# EAGLE design ESP32K40 (EAGLE 9.6.2)
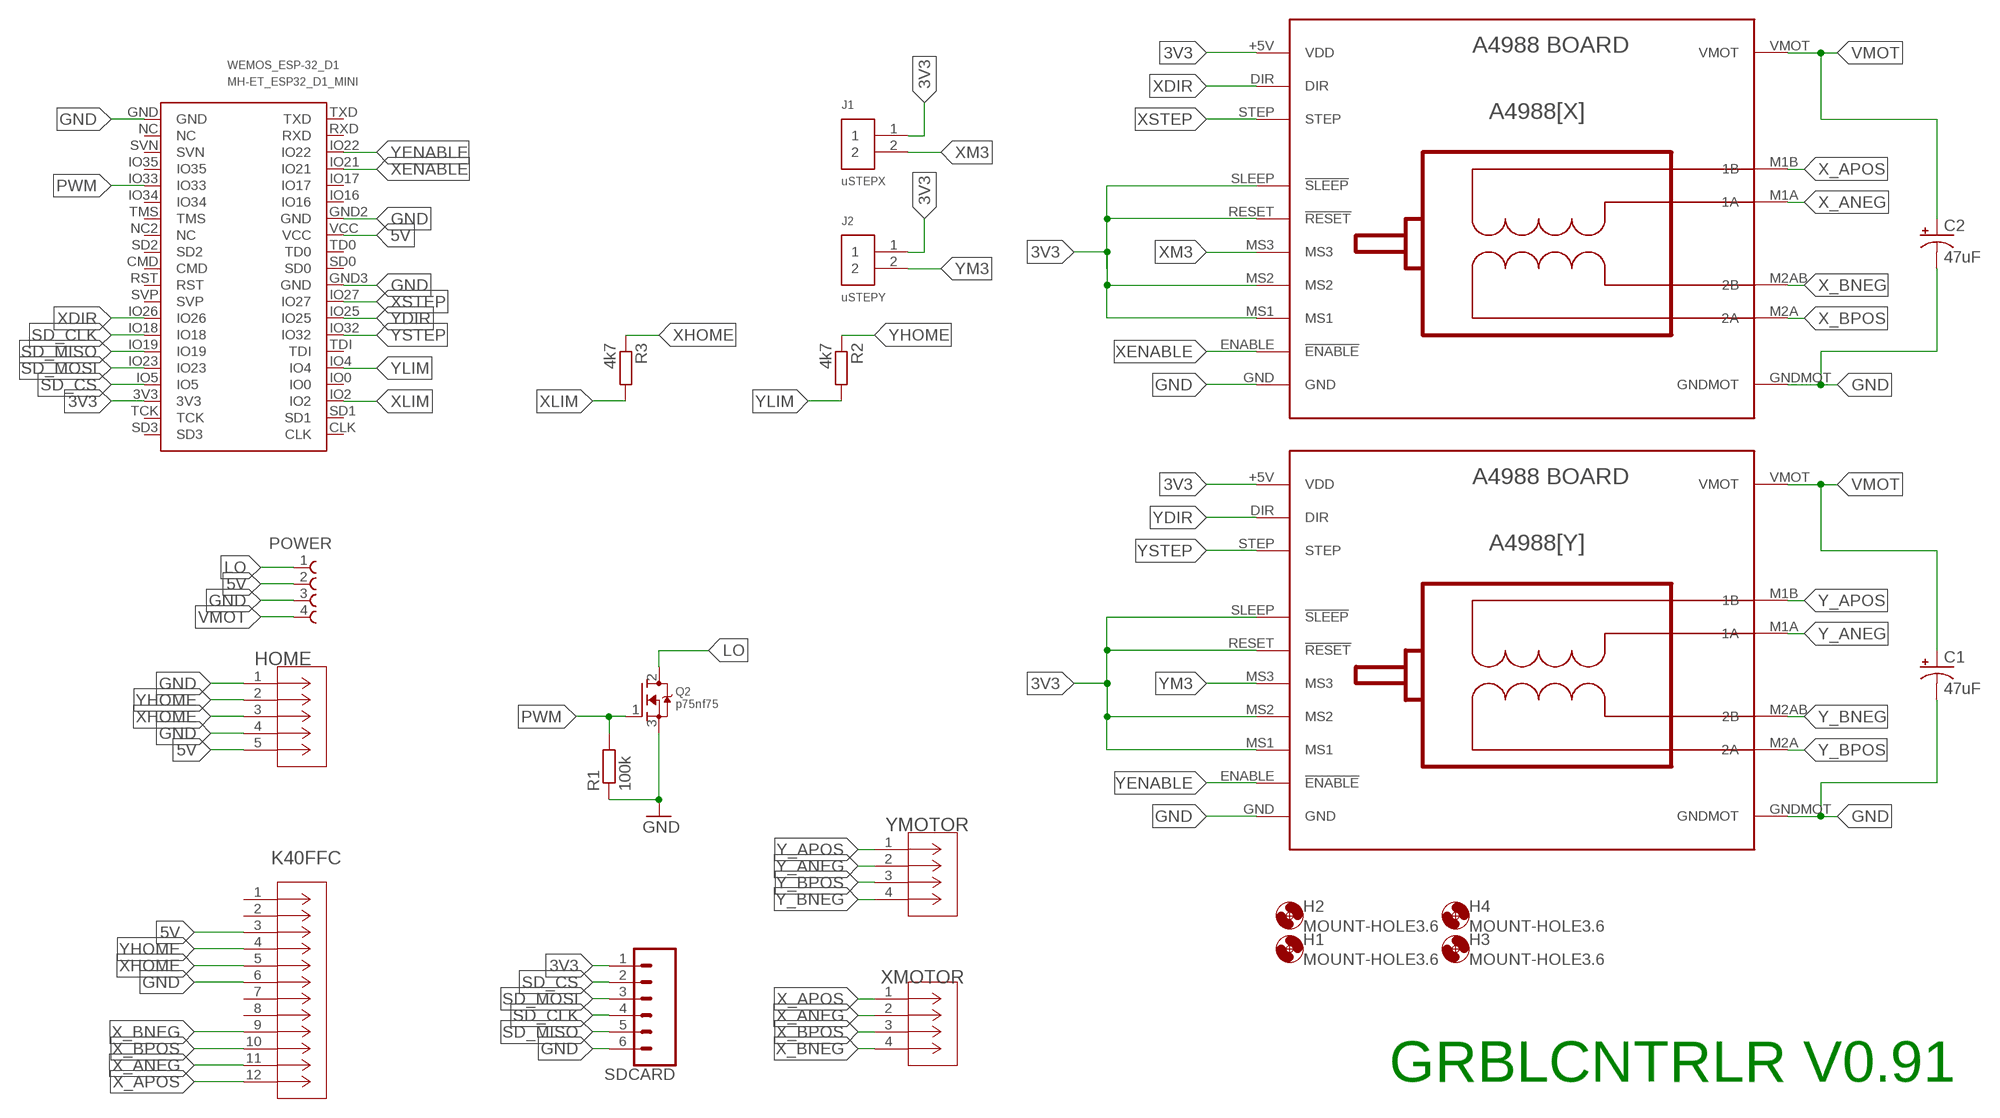
[diagram p0: schematic, sheet 1]

## Parts
A4988[X]  XMOTOR  BOARD_A4988  [BOARD_A4988]
A4988[Y]  YMOTOR  BOARD_A4988  [BOARD_A4988]
C1  47uF  CPOL-USTAP5-70  [TAP5-70]
C2  47uF  CPOL-USTAP5-70  [TAP5-70]
H1  MOUNT-HOLE3.6  [3,6]
H2  MOUNT-HOLE3.6  [3,6]
H3  MOUNT-HOLE3.6  [3,6]
H4  MOUNT-HOLE3.6  [3,6]
HOME  B5B-XH-A(LF)(SN)  [CONN_B5B-XH-A(LF)(SN)_JST]
J1  uSTEPX  61300211121  [61300211121]
J2  uSTEPY  61300211121  [61300211121]
K40FFC  1-84534-2  [CON12_TH_FCC-FPC2]
POWER  691371700004B  [691371700004B]
Q2  p75nf75  MOSFET-NGDS_TO220V  [TO220V]
R1  100k  R-EU_V234/12  [V234/12]
R2  4k7  R-EU_V234/12  [V234/12]
R3  4k7  R-EU_V234/12  [V234/12]
SDCARD  CONN_06LONGPADS  [1X06_LONGPADS]
WEMOS_ESP-32_D1  MH-ET_ESP32_D1_MINI  [MH-ET_ESP32_D1_MINI]
XMOTOR  B4B-XH-A_(LF)(SN)  [CONN_B4B-XH-A_(LF)(SN)_JST]
YMOTOR  B4B-XH-A_(LF)(SN)  [CONN_B4B-XH-A_(LF)(SN)_JST]

## Nets
3V3 [PWR]: A4988[X].+5V(VDD) A4988[X].MS1 A4988[X].MS2 A4988[X].RESET(!RESET) A4988[X].SLEEP(!SLEEP) A4988[Y].+5V(VDD) A4988[Y].MS1 A4988[Y].MS2 A4988[Y].RESET(!RESET) A4988[Y].SLEEP(!SLEEP) J1.1 J2.1 SDCARD.1 WEMOS_ESP-32_D1.3V3
5V [PWR]: HOME.5 K40FFC.3 POWER.2 WEMOS_ESP-32_D1.VCC
GND [MOTOR]: A4988[X].GND A4988[X].GNDMOT A4988[Y].GND A4988[Y].GNDMOT C1.- C2.- HOME.1 HOME.4 K40FFC.6 POWER.3 Q2.3(S) R1.1 SDCARD.6 WEMOS_ESP-32_D1.GND WEMOS_ESP-32_D1.GND2(GND) WEMOS_ESP-32_D1.GND3(GND)
LO: POWER.1 Q2.2(D)
PWM: Q2.1(G) R1.2 WEMOS_ESP-32_D1.IO33
SD_CLK: SDCARD.4 WEMOS_ESP-32_D1.IO18
SD_CS: SDCARD.2 WEMOS_ESP-32_D1.IO5
SD_MISO: SDCARD.5 WEMOS_ESP-32_D1.IO19
SD_MOSI: SDCARD.3 WEMOS_ESP-32_D1.IO23
VMOT [MOTOR]: A4988[X].VMOT A4988[Y].VMOT C1.+ C2.+ POWER.4
X_ANEG [MOTOR]: A4988[X].M1A(1A) K40FFC.11 XMOTOR.2
X_APOS [MOTOR]: A4988[X].M1B(1B) K40FFC.12 XMOTOR.1
X_BNEG [MOTOR]: A4988[X].M2AB(2B) K40FFC.9 XMOTOR.4
X_BPOS [MOTOR]: A4988[X].M2A(2A) K40FFC.10 XMOTOR.3
XDIR: A4988[X].DIR WEMOS_ESP-32_D1.IO26
XENABLE: A4988[X].ENABLE(!ENABLE) WEMOS_ESP-32_D1.IO21
XHOME: HOME.3 K40FFC.5 R3.1
XLIM: R3.2 WEMOS_ESP-32_D1.IO2
XM3: A4988[X].MS3 J1.2
XSTEP: A4988[X].STEP WEMOS_ESP-32_D1.IO27
Y_ANEG [MOTOR]: A4988[Y].M1A(1A) YMOTOR.2
Y_APOS [MOTOR]: A4988[Y].M1B(1B) YMOTOR.1
Y_BNEG [MOTOR]: A4988[Y].M2AB(2B) YMOTOR.4
Y_BPOS [MOTOR]: A4988[Y].M2A(2A) YMOTOR.3
YDIR: A4988[Y].DIR WEMOS_ESP-32_D1.IO25
YENABLE: A4988[Y].ENABLE(!ENABLE) WEMOS_ESP-32_D1.IO22
YHOME: HOME.2 K40FFC.4 R2.1
YLIM: R2.2 WEMOS_ESP-32_D1.IO4
YM3: A4988[Y].MS3 J2.2
YSTEP: A4988[Y].STEP WEMOS_ESP-32_D1.IO32
Unconnected: K40FFC.1 K40FFC.2 K40FFC.7 K40FFC.8 WEMOS_ESP-32_D1.CLK WEMOS_ESP-32_D1.CMD WEMOS_ESP-32_D1.IO0 WEMOS_ESP-32_D1.IO16 WEMOS_ESP-32_D1.IO17 WEMOS_ESP-32_D1.IO34 WEMOS_ESP-32_D1.IO35 WEMOS_ESP-32_D1.NC WEMOS_ESP-32_D1.NC2(NC) WEMOS_ESP-32_D1.RST WEMOS_ESP-32_D1.RXD WEMOS_ESP-32_D1.SD0 WEMOS_ESP-32_D1.SD1 WEMOS_ESP-32_D1.SD2 WEMOS_ESP-32_D1.SD3 WEMOS_ESP-32_D1.SVN WEMOS_ESP-32_D1.SVP WEMOS_ESP-32_D1.TCK WEMOS_ESP-32_D1.TD0 WEMOS_ESP-32_D1.TDI WEMOS_ESP-32_D1.TMS WEMOS_ESP-32_D1.TXD

## Notes on the sheet
- GRBLCNTRLR V0.91

## Library data of the parts
A4988[X] A4988[Y] = Clean-Kong:BOARD_A4988
C1 C2 = adafruit:CPOL-US: POLARIZED CAPACITOR, American symbol
H1-H4 = holes:MOUNT-HOLE: MOUNTING HOLE with drill center marker
HOME = customaj:B5B-XH-A(LF)(SN); BUILT_BY: EMA_Cory; COPYRIGHT: Copyright (C) 2018 Accelerated Designs. All rights reserved; MANUFACTURER_PART_NUMBER: B5B-XH-A(LF)(SN); SOURCELIBRARY: JST_2019-12-02; VENDOR: JST
J1 J2 = Headers:61300211121: CONN HEADER VERT 2POS 2.54MM Manufacturer's datasheet <https://katalog.we-online.de/em/datasheet/6130xx11121.pdf>; CREATED_BY: PCBLayout.com; DIGI_KEY_PART_NUMBER: 732-5315-ND; MANUFACTURER: Wurth Electronics Inc.; MPN: 61300211121
K40FFC = customaj:1-84534-2; BUILT_BY: EMA_UL_Team; COPYRIGHT: Copyright (C) 2016 Accelerated Designs. All rights reserved; MANUFACTURER_PART_NUMBER: 1-84534-2; SOURCELIBRARY: Tyco_2012-1-03; VENDOR: TE Connectivity
POWER = Wurth_Elektronik_Electromechanic_Terminal_Blocks_Connectors_rev19b:691371700004B: WR-TBL Terminal block - serie 371B-5,00mm - PCB Vertical with strong retention force between male and female housing - grey - 4 Pins=>Code : Con_TBL_Pluggable_5.00_PCB_V_691371700004B <http://katalog.we-online.de/media/images/eican/Con_TBL_Pluggable_5.00_PCB_V_6913717000xxB_pf2.jpg> Details see: http://katalog.we-online.de/en/em/TBL_5_00_371B_VERTICAL_MALE_PCB_HEADER_69137170000XB Created 2014-06-23, Karrer Zheng 2014 (C) Würth Elektronik
Q2 = adafruit:MOSFET-N: N-Channel Mosfet 2N7002E - 60V 260mA SOT23 [Digikey: 2N7002ET1GOSTR-ND] - REEL BSH103 - 30V 850mA SOT23 [Digikey: 568-5013-1-ND]
R1 = Clean-Kong:R-EU_: RESISTOR, European symbol
R2 R3 = resistor:R-EU_: RESISTOR, European symbol
SDCARD = SparkFun-Connectors:CONN_06: Multi connection point. Often used as Generic Header-pin footprint for 0.1 inch spaced/style header connections On any of the 0.1 inch spaced packages, you can populate with these: Break Away Headers - Straight <https://www.sparkfun.com/products/116> (PRT-00116) Break Away Male Headers - Right Angle <https://www.sparkfun.com/products/553> (PRT-00553) Female Headers <https://www.sparkfun.com/products/115> (PRT-00115) Break Away Headers - Machine Pin <https://www.sparkfun.com/products/117> (PRT-00117) Break Away Female Headers - Swiss Machine Pin <https://www.sparkfun.com/products/743> (PRT-00743) Arduino Stackable Header - 6 Pin <https://www.sparkfun.com/products/9280> (PRT-09280) For SCREWTERMINALS and SPRING TERMINALS visit here: Screw Terimnals on SparkFun.com <https://www.sparkfun.com/search/results?term=Screw+Terminals> (5mm/3.5mm/2.54mm spacing) This device is also useful as a general connection point to wire up your design to another part of your project. Our various solder wires solder well into these plated through hole pads. Hook-Up Wire - Assortment (Stranded, 22 AWG) <https://www.sparkfun.com/products/11375> (PRT-11375) Hook-Up Wire - Assortment (Solid Core, 22 AWG) <https://www.sparkfun.com/products/11367> (PRT-11367) View the entire wire category on our website here <https://www.sparkfun.com/categories/141>
WEMOS_ESP-32_D1 = MH-ET_ESP32_D1_MINI:MH-ET_ESP32_D1_MINI
XMOTOR YMOTOR = customaj:B4B-XH-A_(LF)(SN); BUILT_BY: EMA_Cory; COPYRIGHT: Copyright (C) 2018 Accelerated Designs. All rights reserved; DATASHEET: http://www.jst-mfg.com/product/pdf/eng/eXH.pdf; MANUFACTURER_PART_NUMBER: B4B-XH-A (LF)(SN); SOURCELIBRARY: JST_2020-02-03; VENDOR: JST

## Net classes
0 default: width 1.219 mm, clearance 0.406 mm
1 MOTOR: width 1.626 mm, clearance 0.61 mm
2 PWR: width 1.626 mm, clearance 0.61 mm

## Board
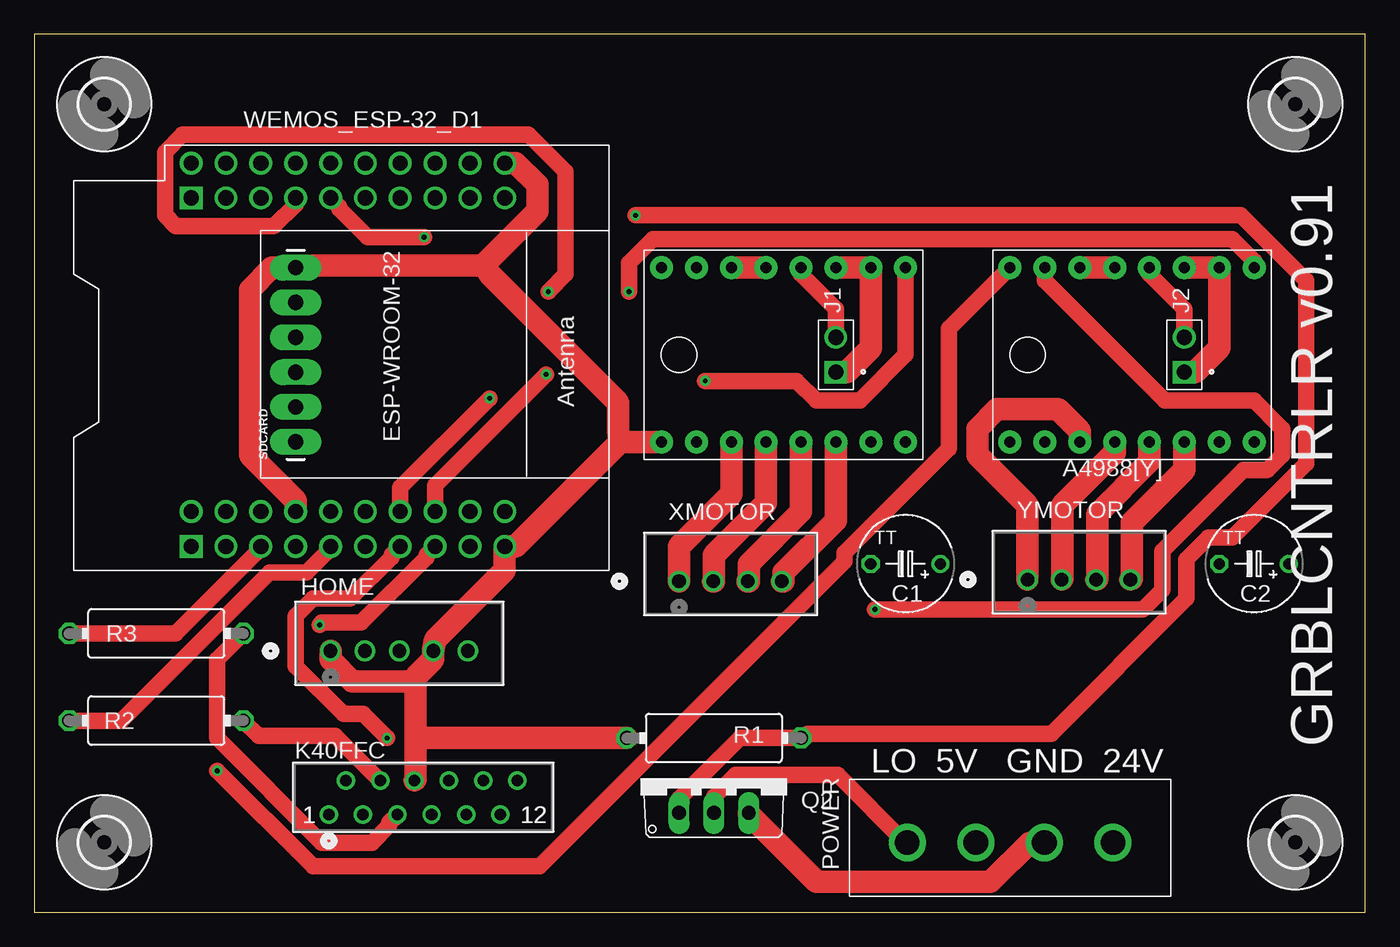
[diagram p1: board, top side]
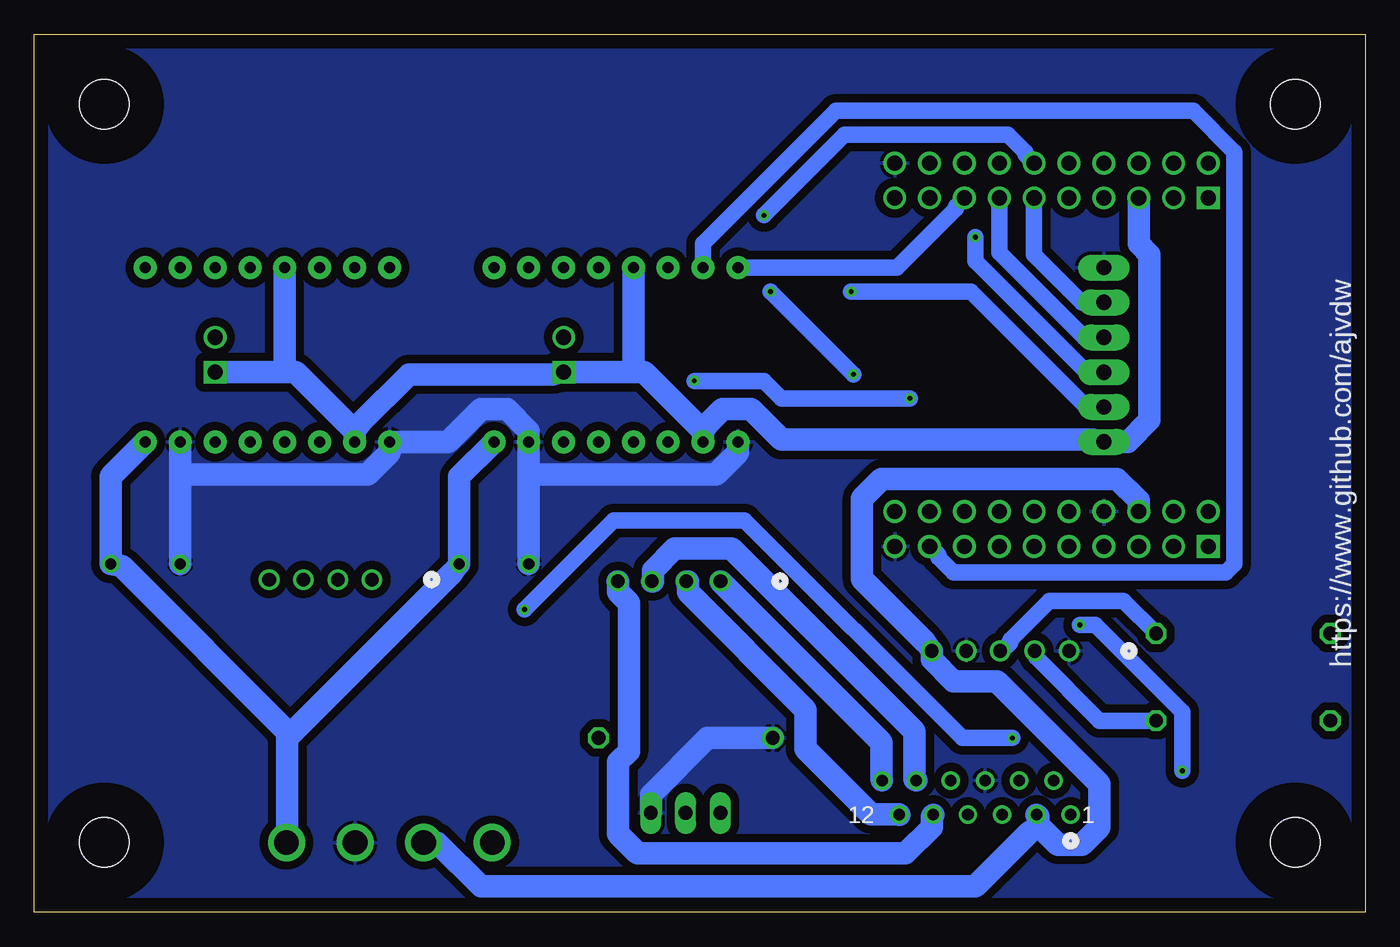
[diagram p2: board, bottom side, seen from below]

Size 97 x 64 mm. Coordinates in mm from the lower left corner, seen from the top.
Outline: 0,0 97,0 97,64 0,64 0,0
Copper layers (1*16): Top 0.035mm / dielectric 1.5mm / Bottom 0.035mm
Design rules "default": minimum track width 6mil, minimum drill 0.35mm, track to track 6mil, track to pad 6mil, pad to pad 6mil, via to via 6mil, smd to smd 6mil, copper to edge 40mil, drill to drill 6mil, minimum pad ring 10mil, minimum via ring 8mil, stop-mask expansion 4mil, vias tented up to drill 0mil, thermal gap 10mil

### Footprints (pad centres in the part's own frame; a part is rotated, then mirrored left to right if it is on the bottom)
BOARD_A4988 = drill 0.8 pad 1.676: +5V 1.27,16.51; DIR 13.97,19.05; ENABLE 13.97,1.27; GND 1.27,19.05; GNDMOT 1.27,3.81; M1A 1.27,11.43; M1B 1.27,13.97; M2A 1.27,8.89; M2AB 1.27,6.35; MS1 13.97,3.81; MS2 13.97,6.35; MS3 13.97,8.89; RESET 13.97,11.43; SLEEP 13.97,13.97; STEP 13.97,16.51; VMOT 1.27,1.27
TAP5-70 = drill 0.813: + -2.54,0 | drill 0.813 octagon: - 2.54,0
3,6 = hole 3.6: 0,0
CONN_B5B-XH-A(LF)(SN)_JST = drill 0.991 pad 1.499: 1 0,0; 2 2.489,0; 3 5.004,0; 4 7.493,0; 5 10.008,0
61300211121 = drill 1.1 square: 1 -1.27,0 | drill 1.1: 2 1.27,0
CON12_TH_FCC-FPC2 = drill 0.838 pad 1.346: 1 0,0; 2 1.245,2.489; 3 2.489,0; 4 3.759,2.489; 5 5.004,0; 6 6.248,2.489; 7 7.493,0; 8 8.738,2.489; 9 10.008,0; 10 11.252,2.489; 11 12.497,0; 12 13.741,2.489
691371700004B = drill 1.8: 1 -7.5,0; 2 -2.5,0; 3 2.5,0; 4 7.5,0
TO220V = drill 1.016 long: 1 -2.54,-2.54; 2 0,-2.54; 3 2.54,-2.54
V234/12 = drill 1.016 octagon: 1 -6.35,0; 2 6.35,0
1X06_LONGPADS = drill 1.118 pad 1.88 long: 1 0,0; 2 2.54,0; 3 5.08,0; 4 7.62,0; 5 10.16,0; 6 12.7,0
MH-ET_ESP32_D1_MINI = drill 1.11 pad 1.665: 3V3 25.4,-5.08; CMD 27.94,0; GND 0,-22.86; GND2 2.54,-7.62; GND3 27.94,-22.86; IO0 0,-7.62; IO2 0,-5.08; IO4 0,-10.16; IO5 25.4,-7.62; IO16 2.54,-10.16; IO17 2.54,-12.7; IO18 25.4,-15.24; IO19 25.4,-12.7; IO21 2.54,-15.24; IO22 2.54,-17.78; IO23 25.4,-10.16; IO25 0,-17.78; IO26 25.4,-17.78; IO27 0,-20.32; IO32 0,-15.24; IO33 27.94,-12.7; IO34 27.94,-10.16; IO35 27.94,-15.24; NC 27.94,-20.32; NC2 27.94,-5.08; RST 25.4,-22.86; RXD 2.54,-20.32; SD0 2.54,0; SD1 0,-2.54; SD2 27.94,-2.54; SVN 27.94,-17.78; SVP 25.4,-20.32; TCK 25.4,-2.54; TD0 2.54,-2.54; TDI 0,-12.7; TMS 27.94,-7.62; TXD 2.54,-22.86; VCC 2.54,-5.08 | drill 1.11 pad 1.665 square: CLK 0,0; SD3 25.4,0
CONN_B4B-XH-A_(LF)(SN)_JST = drill 0.991 pad 1.499: 1 0,0; 2 2.489,0; 3 5.004,0; 4 7.493,0

### Placement (x,y rotation side)
A4988[X]  64.77,33.02 90 top
A4988[Y]  90.17,33.02 90 top
C1  63.5,25.4 180 top
C2  88.9,25.4 180 top
H1  5.1,58.9 0 top
H2  91.9,5.1 0 top
H3  5.1,5.1 0 top
H4  91.9,58.9 0 top
HOME  21.59,19.05 0 top
J1  58.42,40.64 90 top
J2  83.82,40.64 90 top
K40FFC  21.46,7.11 0 top
POWER  71.12,5.08 0 top
Q2  49.53,9.78 0 top
R1  49.53,12.7 0 top
R2  8.89,13.97 180 top
R3  8.89,20.32 180 top
SDCARD  19.05,34.29 90 top
WEMOS_ESP-32_D1  11.43,26.67 90 top
XMOTOR  46.99,24.13 0 top
YMOTOR  72.39,24.26 0 top

### Tracks (layer width: path | path; a pad name or v marks a point on that pad's centre or on a via)
3V3
  Top 1.626: A4988[Y].RESET A4988[Y].SLEEP | J2.1 84.61,39.37 86.36,41.12 A4988[Y].MS1 A4988[Y].MS2 | A4988[X].RESET A4988[X].SLEEP | J1.1 59.21,39.37 60.96,41.12 A4988[X].MS1 A4988[X].MS2
  Bottom 1.626: 73.66,35.08 A4988[Y].+5V | 73.66,35.08 77.95,39.37 78.74,39.37 | J2.1 78.74,39.37 | 78.74,39.37 A4988[Y].RESET | WEMOS_ESP-32_D1.3V3 16.51,48.74 15.72,47.94 15.72,35.88 17.3,34.29 SDCARD.1 19.84,34.45 42.55,34.45 44.77,36.67 46.83,36.67 47.78,35.72 48.26,35.08 | 48.26,35.08 A4988[X].+5V | 48.26,35.08 52.55,39.37 53.34,39.37 | 53.34,39.37 J1.1 59.21,39.21 69.69,39.21 73.18,35.72 73.66,35.08 | 53.34,39.37 A4988[X].RESET
5V
  Bottom 1.626: 23.81,6.35 23.81,6.99 K40FFC.3 | 23.81,6.35 22.38,4.92 20.64,4.92 19.37,6.19 19.37,9.37 26.83,16.83 30,16.83 31.59,18.41 HOME.5 | HOME.5 | WEMOS_ESP-32_D1.VCC 16.51,30 18.1,31.59 35.24,31.59 36.67,30.16 36.67,24.29 32.07,19.68 HOME.5 | POWER.2 67.63,5.08 64.45,1.91 28.42,1.91 24.45,5.87 23.81,6.35
GND
  Top 1.626: WEMOS_ESP-32_D1.GND2 19.05,30 15.72,33.34 15.72,45.4 17.3,46.99 SDCARD.6 19.84,47.15 32.7,47.15 | WEMOS_ESP-32_D1.GND3 35.08,54.61 36.67,53.02 36.67,51.12 32.7,47.15 | POWER.3 72.55,5.08 69.69,2.22 56.99,2.22 52.07,7.14 Q2.3 | 27.78,16.83 27.78,17.14 29.05,18.41 29.05,19.05 | 27.78,16.83 27.78,12.7 | 27.78,12.7 27.78,9.68 K40FFC.6 | 29.05,19.05 HOME.4 | HOME.1 21.59,18.41 23.18,16.83 27.78,16.83 | 29.05,19.05 29.21,19.84 34.29,24.92 WEMOS_ESP-32_D1.GND 35.08,26.67 42.7,34.29 | 42.7,34.29 A4988[X].GND | 27.78,12.7 R1.1 | 32.7,47.15 33.18,46.51 42.55,37.15 42.55,35.08 42.7,34.29
  Bottom 1.626: R1.1 47.94,12.7 52.07,8.57 Q2.3 | A4988[Y].GNDMOT 86.36,31.91 | 86.36,31.91 C2.- | 60.96,31.91 A4988[X].GNDMOT 60.96,35.08 62.55,36.67 64.45,36.67 66.83,34.29 A4988[Y].GND 71.12,33.5 72.71,31.91 86.36,31.91 | 60.96,31.91 C1.- | 60.96,31.91 47.31,31.91 45.72,33.5 A4988[X].GND
  pour Bottom (isolate 0.254): 0,64.77 97.79,64.77 97.79,63.5 97.79,-1.27 0,-1.27
LO
  Top 1.219: Q2.2 49.53,8.41 51.12,10 58.58,10 63.5,5.08 POWER.1
PWM  (via drill 0.35)
  Top 1.219: Q2.1 46.99,8.26 51.44,12.7 R1.2 56.36,13.02 74.14,13.02 83.98,22.86 83.98,25.72 85.57,27.3 87.31,27.3 92.71,32.7 92.71,46.04 87.95,50.8 v43.81,50.8
  Bottom 1.219: WEMOS_ESP-32_D1.IO33 24.77,55.24 24.77,55.4 26.04,56.67 37.94,56.67 v43.81,50.8
SD_CLK
  Bottom 1.219: WEMOS_ESP-32_D1.IO18 26.67,48.1 20.48,41.91 SDCARD.4
SD_CS  (via drill 0.35)
  Top 1.219: WEMOS_ESP-32_D1.IO5 19.05,51.59 17.46,50.01 10.32,50.01 9.53,50.8 9.53,55.4 10.79,56.67 36.04,56.67 38.73,53.98 38.73,46.51 v37.47,45.24
  Bottom 1.219: v37.47,45.24 28.73,45.24 20.32,36.83 SDCARD.2
SD_MISO
  Bottom 1.219: WEMOS_ESP-32_D1.IO19 24.13,47.94 20.64,44.45 SDCARD.5
SD_MOSI  (via drill 0.35)
  Top 1.219: WEMOS_ESP-32_D1.IO23 22.23,51.44 22.23,51.28 24.29,49.21 v28.42,49.21
  Bottom 1.219: v28.42,49.21 28.42,47.47 20.32,39.37 SDCARD.3
VMOT
  Bottom 1.626: A4988[Y].VMOT 91.44,31.75 C2.+ 90.65,25.24 78.34,12.94 | A4988[X].VMOT 66.04,31.75 C1.+ 66.52,24.77 78.34,12.94 | 78.34,12.94 78.58,12.7 78.58,5.08 POWER.4
X_ANEG
  Top 1.626: A4988[X].M1A 53.34,29.84 49.53,26.04 49.53,24.13 XMOTOR.2
  Bottom 1.626: K40FFC.11 33.97,7.14 36.04,7.14 40.8,11.91 40.8,14.76 49.37,23.34 49.37,24.13 XMOTOR.2
X_APOS
  Top 1.626: A4988[X].M1B 50.8,30.48 46.99,26.67 XMOTOR.1
  Bottom 1.626: XMOTOR.1 35.24,12.38 35.24,9.68 K40FFC.12
X_BNEG
  Top 1.626: A4988[X].M2AB 58.42,28.57 54.61,24.77 54.61,24.13 XMOTOR.4
  Bottom 1.626: K40FFC.9 31.59,6.99 31.59,6.19 33.5,4.29 53.02,4.29 54.45,5.71 54.45,10.95 53.66,11.75 53.66,22.54 54.45,23.34 54.45,24.13 XMOTOR.4
X_BPOS
  Top 1.626: A4988[X].M2A 55.88,29.21 52.07,25.4 52.07,24.13 XMOTOR.3
  Bottom 1.626: K40FFC.10 32.86,9.68 32.86,13.18 46.2,26.51 50.32,26.51 51.91,24.92 51.91,24.13 XMOTOR.3
XDIR
  Bottom 1.219: WEMOS_ESP-32_D1.IO26 29.84,51.44 29.84,51.28 34.13,46.99 A4988[X].DIR
XENABLE  (via drill 0.35)
  Top 1.219: WEMOS_ESP-32_D1.IO21 26.67,30.96 v33.18,37.47 | v48.9,38.73 55.56,38.73 56.99,37.31 60.17,37.31 63.5,40.64 A4988[X].ENABLE
  Bottom 1.219: v33.18,37.47 42.55,37.47 43.81,38.73 v48.9,38.73
XHOME
  Top 1.219: R3.1 13.34,18.41 13.34,12.7 20.95,5.08 24.61,5.08 25.88,6.35 25.88,6.51 26.35,6.99 K40FFC.5
  Bottom 1.219: R3.1 17.62,22.7 23.02,22.7 25.88,19.84 25.88,19.68 26.51,19.05 HOME.3
XLIM
  Top 1.219: R3.2 10.32,20.32 16.51,26.51 WEMOS_ESP-32_D1.IO2
XM3
  Top 1.219: J1.2 58.42,43.97 55.88,46.51 A4988[X].MS3
XSTEP
  Bottom 1.219: WEMOS_ESP-32_D1.IO27 31.11,26.04 31.11,25.88 30,24.77 10.16,24.77 9.53,25.4 9.53,55.4 12.54,58.42 38.58,58.42 48.26,48.74 A4988[X].STEP
Y_ANEG
  Top 1.626: A4988[Y].M1A 78.74,33.5 74.93,29.69 74.93,24.29 YMOTOR.2
Y_APOS
  Top 1.626: YMOTOR.1 72.39,29.69 68.74,33.34 68.74,35.24 70.17,36.67 74.61,36.67 76.2,35.08 A4988[Y].M1B
Y_BNEG
  Top 1.626: A4988[Y].M2AB 83.82,32.23 80.01,28.42 80.01,24.29 YMOTOR.4
Y_BPOS
  Top 1.626: A4988[Y].M2A 81.28,32.86 77.47,29.05 77.47,24.29 YMOTOR.3
YDIR  (via drill 0.35)
  Top 1.219: WEMOS_ESP-32_D1.IO25 28.57,26.04 28.57,25.88 23.81,21.11 20.95,21.11 v20.8,20.95 | v13.34,10.32 20.32,3.33 36.83,3.33 59.05,25.56 59.05,26.19 66.67,33.81 66.67,42.55 A4988[Y].DIR
  Bottom 1.219: v20.8,20.95 19.68,20.95 13.34,14.61 v13.34,10.32
YENABLE  (via drill 0.35)
  Top 1.219: WEMOS_ESP-32_D1.IO22 29.21,31.11 v37.31,39.21 | v43.34,45.24 43.34,47.31 45.09,49.05 87.31,49.05 88.9,47.47 A4988[Y].ENABLE
  Bottom 1.219: v43.34,45.24 v37.31,39.21
YHOME
  Top 1.219: R2.1 16.35,12.86 21.91,12.86 25.08,9.68 K40FFC.4
  Bottom 1.219: R2.1 19.37,13.97 23.97,18.57 23.97,19.05 HOME.2
YLIM
  Top 1.219: R2.2 6.35,13.97 17.14,24.77 19.84,24.77 21.59,26.51 WEMOS_ESP-32_D1.IO4
YM3
  Top 1.219: J2.2 83.82,43.97 81.28,46.51 A4988[Y].MS3
YSTEP  (via drill 0.35)
  Top 1.219: WEMOS_ESP-32_D1.IO32 26.04,26.04 26.04,25.88 23.02,22.86 20.32,22.86 19.05,21.59 19.05,17.94 22.54,14.45 23.97,14.45 v25.72,12.7 | v61.28,22.07 80.8,22.07 82.23,23.5 82.23,26.35 88.11,32.23 89.85,32.23 90.96,33.34 90.96,35.24 88.9,37.31 82.39,37.31 73.66,46.04 A4988[Y].STEP
  Bottom 1.219: v25.72,12.7 29.37,12.7 45.24,28.57 54.77,28.57 v61.28,22.07

### Text on the board
tNames: GRBLCNTRLR v0.91 | LO 5V GND 24V
bNames: https://www.github.com/ajvdw